# Altium schematic sheet Sensors.SchDoc
size A
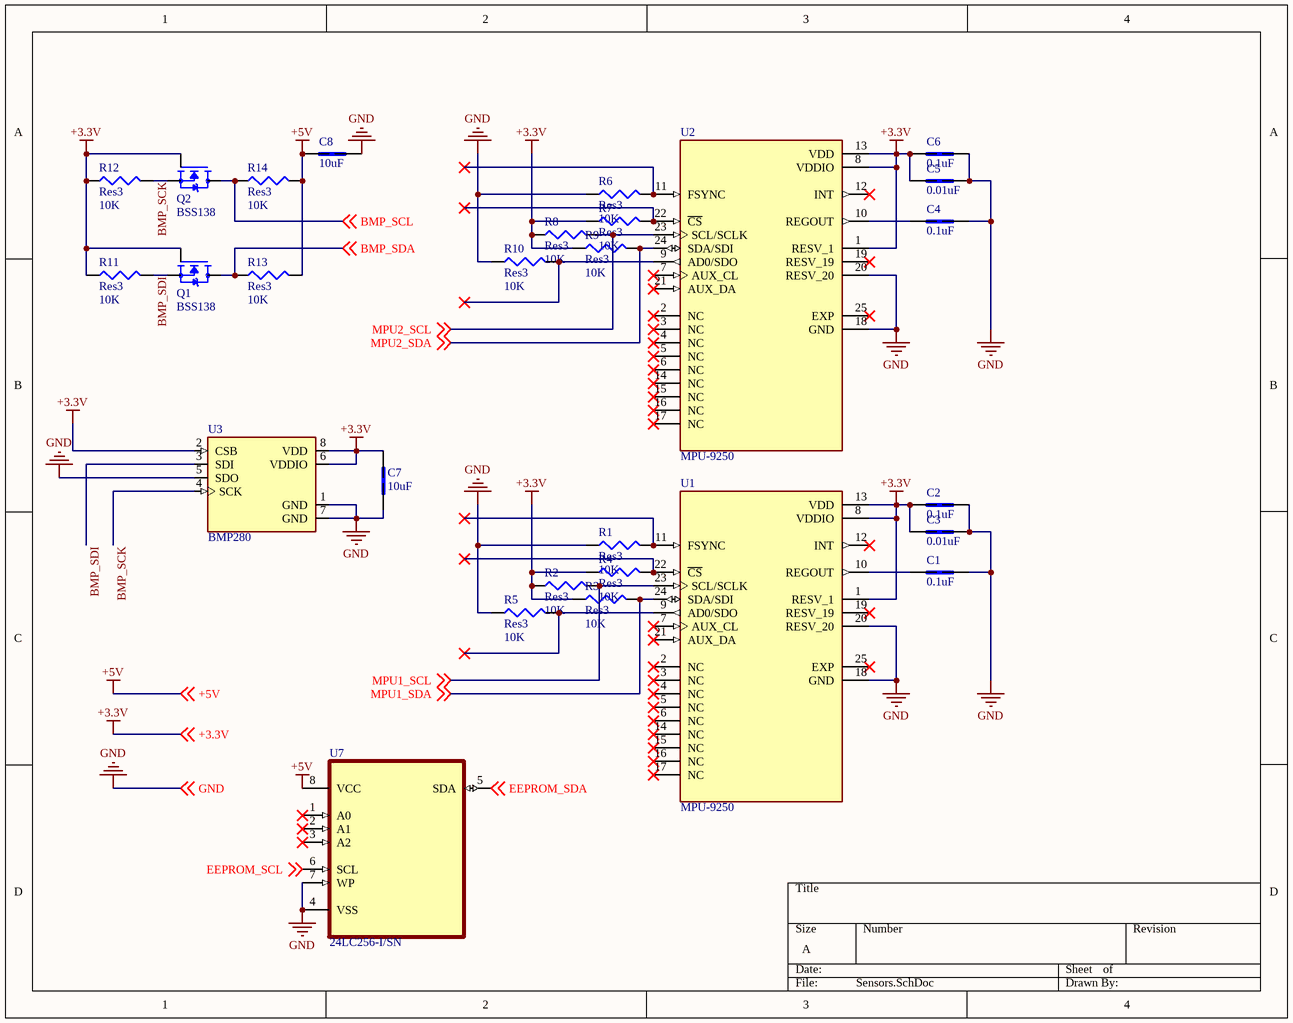
[diagram p0: Sensors.SchDoc]

## Parts
C1  0.1uF  [CAPC1608X90]
C2  0.1uF  [CAPC1608X90]
C3  0.01uF  [CAPC1608X90]
C4  0.1uF  [CAPC1608X90]
C5  0.01uF  [CAPC1608X90]
C6  0.1uF  [CAPC1608X90]
C7  10uF  [CAPC1608X90]
C8  10uF  [CAPC1608X90]
Q1  BSS138  [SOT95P240X111-3N]
Q2  BSS138  [SOT95P240X111-3N]
R1  Res3  value 10K  [J1-0603]
R2  Res3  value 10K  [J1-0603]
R3  Res3  value 10K  [J1-0603]
R4  Res3  value 10K  [J1-0603]
R5  Res3  value 10K  [J1-0603]
R6  Res3  value 10K  [J1-0603]
R7  Res3  value 10K  [J1-0603]
R8  Res3  value 10K  [J1-0603]
R9  Res3  value 10K  [J1-0603]
R10  Res3  value 10K  [J1-0603]
R11  Res3  value 10K  [J1-0603]
R12  Res3  value 10K  [J1-0603]
R13  Res3  value 10K  [J1-0603]
R14  Res3  value 10K  [J1-0603]
U1  MPU-9250  [QFN40P300X300X105-25N]
U2  MPU-9250  [QFN40P300X300X105-25N]
U3  BMP280  [XDCR_BMP280]
U7  24LC256-I/SN  [SOIC127P600X175-8N]

## Nets
+3.3V: C2.1 C3.1 C5.1 C6.1 C7.1 Q1.1(G) Q2.1(G) R2.1 R3.1 R4.1 R7.1 R8.1 R9.1 R11.1 R12.1 U1.1(RESV_1) U1.8(VDDIO) U1.13(VDD) U2.1(RESV_1) U2.8(VDDIO) U2.13(VDD) U3.2(CSB) U3.6(VDDIO) U3.8(VDD) ; off-sheet +3.3V
+5V: C8.1 R13.2 R14.2 U7.8(VCC) ; off-sheet +5V
GND: C1.2 C2.2 C3.2 C4.2 C5.2 C6.2 C7.2 C8.2 R1.1 R5.1 R6.1 R10.1 U1.18(GND) U1.20(RESV_20) U2.18(GND) U2.20(RESV_20) U3.1(GND) U3.5(SDO) U3.7(GND) U7.4(VSS) U7.7(WP) ; off-sheet GND
BMP_SCK: Q2.2(S) R12.2 U3.4(SCK)
BMP_SCL: Q2.3(D) R14.1 ; off-sheet BMP_SCL
BMP_SDA: Q1.3(D) R13.1 ; off-sheet BMP_SDA
BMP_SDI: Q1.2(S) R11.2 U3.3(SDI)
EEPROM_SCL: U7.6(SCL) ; off-sheet EEPROM_SCL
EEPROM_SDA: U7.5(SDA) ; off-sheet EEPROM_SDA
MPU1_SCL: R2.2 U1.23(SCL/SCLK) ; off-sheet MPU1_SCL
MPU1_SDA: R3.2 U1.24(SDA/SDI) ; off-sheet MPU1_SDA
MPU2_SCL: R8.2 U2.23(SCL/SCLK) ; off-sheet MPU2_SCL
MPU2_SDA: R9.2 U2.24(SDA/SDI) ; off-sheet MPU2_SDA
NetC1_1: C1.1 U1.10(REGOUT)
NetC4_1: C4.1 U2.10(REGOUT)
NetR1_2: R1.2 U1.11(FSYNC)
NetR4_2: R4.2 U1.22(~{CS})
NetR5_2: R5.2 U1.9(AD0/SDO)
NetR6_2: R6.2 U2.11(FSYNC)
NetR7_2: R7.2 U2.22(~{CS})
NetR10_2: R10.2 U2.9(AD0/SDO)

Not connected (* = marked no-connect by the designer): U1 2(NC)* 3(NC)* 4(NC)* 5(NC)* 6(NC)* 7(AUX_CL)* 12(INT)* 14(NC)* 15(NC)* 16(NC)* 17(NC)* 19(RESV_19)* 21(AUX_DA)* 25(EXP)*; U2 2(NC)* 3(NC)* 4(NC)* 5(NC)* 6(NC)* 7(AUX_CL)* 12(INT)* 14(NC)* 15(NC)* 16(NC)* 17(NC)* 19(RESV_19)* 21(AUX_DA)* 25(EXP)*; U7 1(A0)* 2(A1)* 3(A2)*

## Library data of the parts
C1-C8 = C0603C104K5RACTU: 0.1ÂµF Â±10% 50V Ceramic Capacitor X7R 0603 (1608 Metric); MF: KEMET; SnapEDA_Link: https://www.snapeda.com/parts/C0603C104K5RACTU/KEMET/view-part/52584/?ref=snap; MP: C0603C104K5RACTU; Check_prices: https://www.snapeda.com/parts/C0603C104K5RACTU/KEMET/view-part/52584/?ref=eda; Digi-Key_Part_Number: 399-5089-1-ND; Value: *; Package: 0603 Kemet; Purchase-URL: https://pricing.snapeda.com/search/part/C0603C104K5RACTU/?ref=eda
Q1 Q2 = BSS138: N-Channel 50V 220mA (Ta) 360mW (Ta) Surface Mount SOT-23-3; Price: None; MP: BSS138; Value: *; Availability: Unavailable; Package: None
R1-R14 = Res3: Resistor; Published: 8-Jun-2000; LatestRevisionDate: 29-May-2009; LatestRevisionNote: IPC-7351 Footprint Added.; PackageReference: J1-0603; Publisher: Altium Limited; PackageDescription: Chip Resistor
U1 U2 = MPU-9250: MPU-9250 series Accelerometer, Gyroscope, Humidity, Magnetometer, Pressure, Temperature Sensor Evaluation Board; MF: TDK InvenSense; Package: TFQFN-24 TDK InvenSense; Purchase-URL: https://pricing.snapeda.com/search/part/MPU-9250/?ref=eda; Value: *; Price: None; Check_prices: https://www.snapeda.com/parts/MPU-9250/TDK+InvenSense/view-part/?ref=eda; MP: MPU-9250; SnapEDA_Link: https://www.snapeda.com/parts/MPU-9250/TDK+InvenSense/view-part/?ref=snap; Availability: In Stock
U3 = BMP280: BMP280 Absolute Barometric Pressure Sensor for Battery Powered Devices 2 x 2.5mm; Value: *; Availability: Unavailable; Price: None; MP: BMP280; Package: None
U7 = 24LC256-I/SN: EEPROM Memory IC 256Kb _32K x 8_ IÂ²C 400kHz 900ns 8-SOIC; MF: Microchip; Value: *; MP: 24LC256-I/SN; Package: SOIC-8 Microchip; SnapEDA_Link: https://www.snapeda.com/parts/24LC256-I/SN/Microchip/view-part/9771/?ref=snap; Price: None; Availability: Unavailable